# EAGLE schematic SpockVoice (EAGLE 7.6.0)
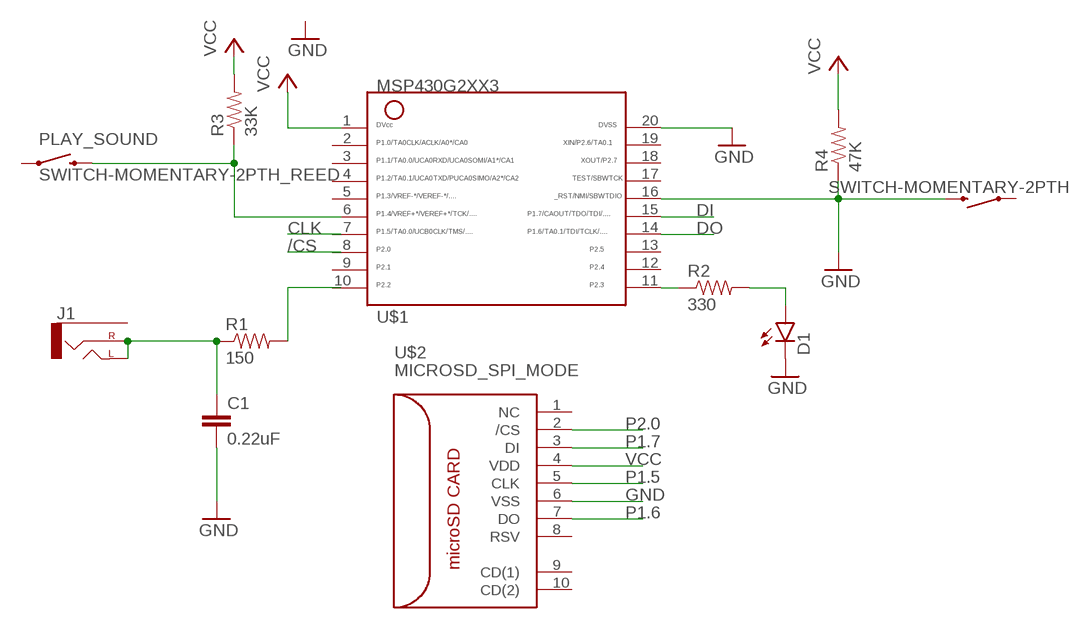
[diagram p0: schematic, sheet 1]

## Parts
C1  0.22uF  0.22UF-25V-10%(0603)  [0603-CAP]
D1  LED5MM  [LED5MM]
J1  AUDIO-JACK2.5MM  [STEREOJACK2.5MM_STEREOJACK2.5MM]
PLAY_SOUND  SWITCH-MOMENTARY-2PTH_REED  [REED_SWITCH_PTH]
R1  150  RESISTORPTH-1/2W  [AXIAL-0.5]
R2  330  RESISTORPTH-1/2W  [AXIAL-0.5]
R3  33K  RESISTORPTH-1/2W  [AXIAL-0.5]
R4  47K  RESISTORPTH-1/2W  [AXIAL-0.5]
RESET  SWITCH-MOMENTARY-2PTH  [TACTILE-PTH]
U$1  G2XX3---PW20  [PW20]
U$2  MICROSD_SPI_MODE  [MICRO_SD_CONNECTOR]

## Nets
DI: U$1.15
DO: U$1.14
GND: C1.2 D1.K(C) R4.P$1 RESET.3 U$1.16 U$1.20 U$2.6(VSS)
N$2: C1.1 J1.SHIELD(LEFT) J1.TIP(RIGHT) R1.P$1
N$3: R1.P$2
N$4: R2.P$1 U$1.11
N$5: D1.A R2.P$2
N$6: PLAY_SOUND.P$2 R3.P$1
P1.5: U$2.5(CLK)
P1.6: U$2.7(DO)
P1.7: U$2.3(DI)
P2.0: U$2.2(/CS)
VCC: R3.P$2 R4.P$2 U$2.4(VDD)
Unconnected: J1.RING1(SLEEVE) PLAY_SOUND.P$1 RESET.1 U$1.1 U$1.2 U$1.3 U$1.4 U$1.5 U$1.6 U$1.7 U$1.8 U$1.9 U$1.10 U$1.12 U$1.13 U$1.17 U$1.18 U$1.19 U$2.1(NC) U$2.8(RSV) U$2.9(CD(1)) U$2.10(CD(2))

## Library data of the parts
C1 = SparkFun-Capacitors:0.22UF-25V-10%(0603): CAP-07822; PROD_ID: CAP-07822
D1 = SparkFun-LED:LED: LEDs Standard schematic elements and footprints for 5mm, 3mm, 1206, and 0603 sized LEDs. 5mm - Spark Fun Electronics SKU : COM-00529 (and others)
J1 = SparkFun-Connectors:AUDIO-JACK: 3.5mm Audio Jack Simple 3.5mm common PCB mount audio jack. Variant PTH is our storefront SKU PRT-08032
PLAY_SOUND = SparkFun-Electromechanical:SWITCH-MOMENTARY-2: Various NO switches- pushbuttons, reed, etc
R1-R4 = SparkFun-Passives:RESISTOR: Resistor Basic schematic elements and footprints for 0603, 1206, and PTH resistors.
RESET = SparkFun-Electromechanical:SWITCH-MOMENTARY-2: Various NO switches- pushbuttons, reed, etc; PROD_ID: SWCH-08441
U$1 = TI_MSP430_v16:G2XX3---PW20: MSP430G2XX1 TSSOP (PW) 20 Pin Package
U$2 = con-molex-microsd:MICROSD_SPI_MODE: MOLEX - 49225-0821 - CONNECTEUR MICRO SD PUSH/PUSH REV Fabricant: MOLEX Code commande Farnell: 1366700 <http://fr.farnell.com/molex/49225-0821/connecteur-micro-sd-push-push-rev/dp/1366700?Ntt=1366700> Référence fabricant: 49225-0821